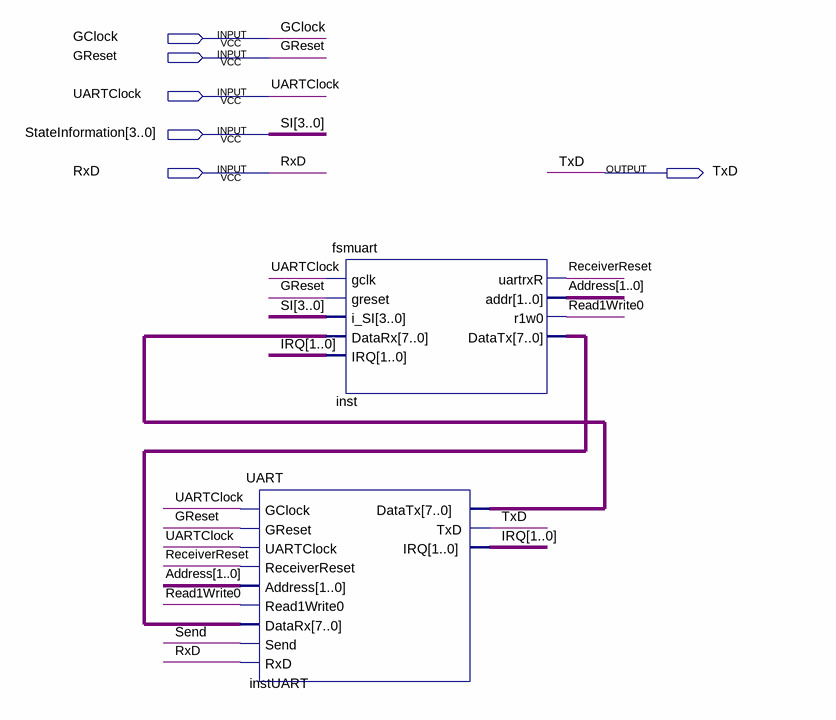
[diagram p0: schematic sheet]
// Quartus schematic UARTTop.bdf as structural Verilog: 2 symbols, 6 pins
module UARTTop (
  input  GClock,
  input  GReset,
  input  UARTClock,
  input  [3:0] StateInformation,
  input  RxD,
  output TxD
);

  wire Read1Write0, ReceiverReset, Send;
  wire [1:0] Address, IRQ;
  wire [7:0] inst_datatx, instUART_datatx;

  UART instUART (
    .GClock(UARTClock), .GReset(GReset), .UARTClock(UARTClock), .ReceiverReset(ReceiverReset),
    .Address(Address), .Read1Write0(Read1Write0), .DataRx(inst_datatx), .Send(Send), .RxD(RxD),
    .DataTx(instUART_datatx), .TxD(TxD), .IRQ(IRQ));
  fsmuart inst (
    .gclk(UARTClock), .greset(GReset), .i_SI(StateInformation), .DataRx(instUART_datatx), .IRQ(IRQ),
    .uartrxR(ReceiverReset), .addr(Address), .r1w0(Read1Write0), .DataTx(inst_datatx));

  // Other names for the same wires on the sheet: SI[3:0] = StateInformation
endmodule
